# Altium schematic sheet PID Schematic.SchDoc
size 508 x 304 mm
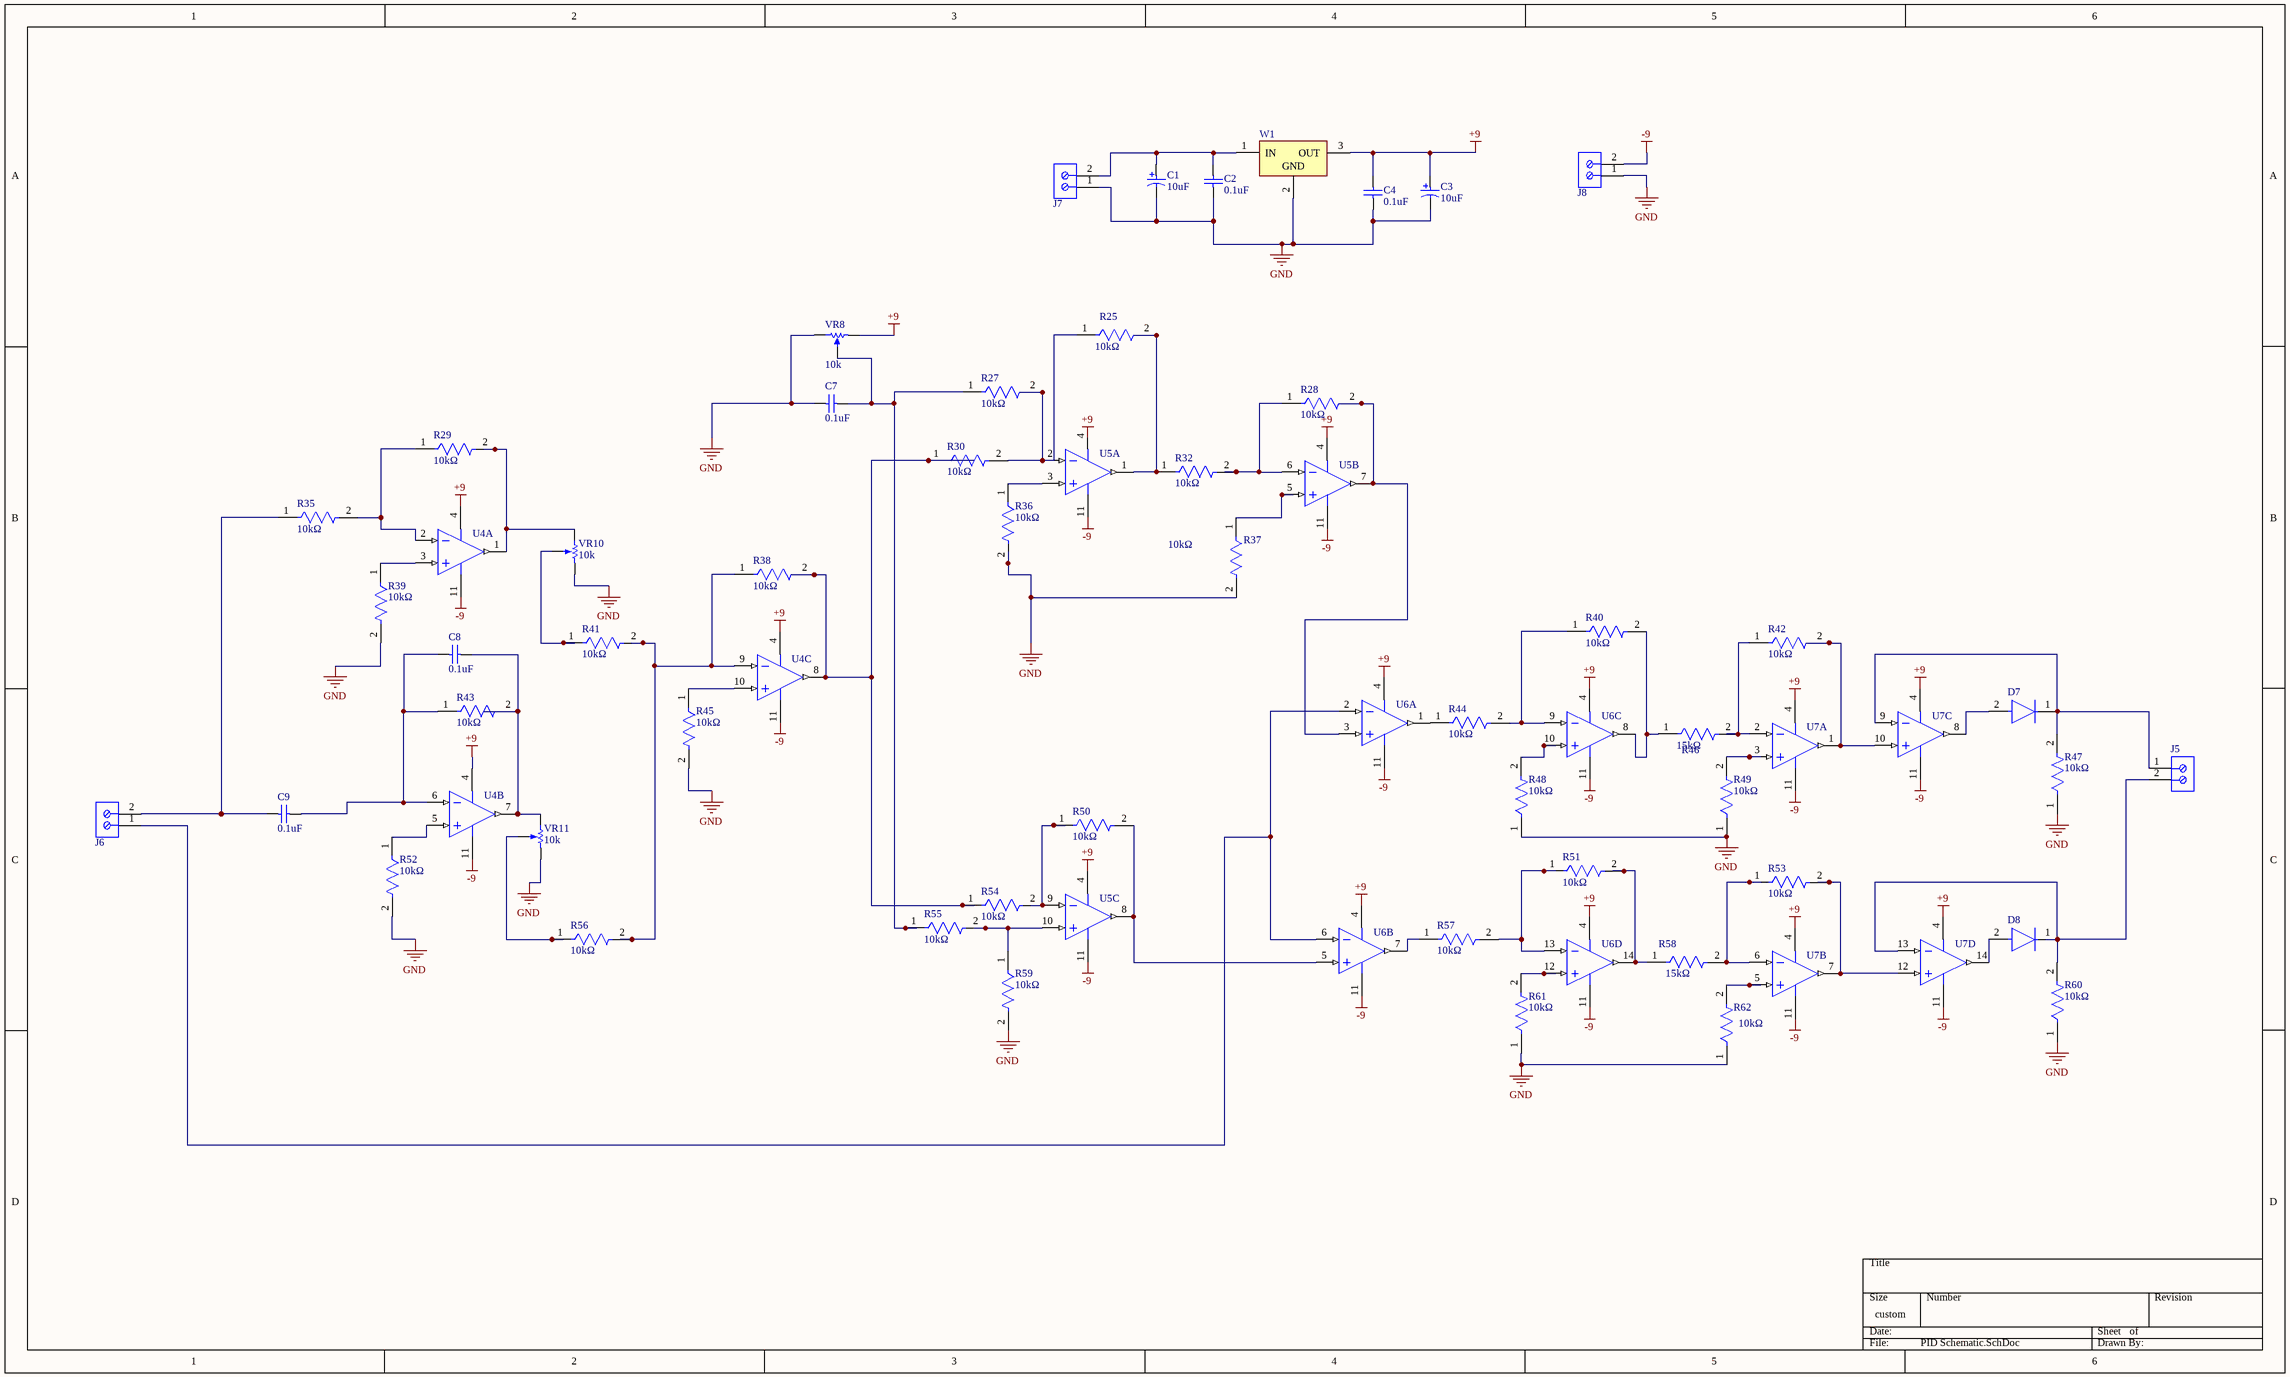
[diagram p0: PID Schematic.SchDoc]

## Parts
C1  Capacitance: 10uF  [CAPPR55-200-1100X500X1200]  (hidden comment: ECA1HM100)
C2  value 0.1uF  [CAPR51-254-508X318X736]  (hidden comment: C320C104K5R5TA)
C3  Capacitance: 10uF  [CAPPR55-200-1100X500X1200]  (hidden comment: ECA1HM100)
C4  value 0.1uF  [CAPR51-254-508X318X736]  (hidden comment: C320C104K5R5TA)
C7  value 0.1uF  [CAPR51-254-508X318X736]  (hidden comment: C320C104K5R5TA)
C8  value 0.1uF  [CAPR51-254-508X318X736]  (hidden comment: C320C104K5R5TA)
C9  value 0.1uF  [CAPR51-254-508X318X736]  (hidden comment: C320C104K5R5TA)
D7  1N4148  [FP-017AG-MFG]  (value not drawn)
D8  1N4148  [FP-017AG-MFG]  (value not drawn)
J5  691103110002  [691103110002]  (value not drawn)
J6  691103110002  [691103110002]  (value not drawn)
J7  691103110002  [691103110002]  (value not drawn)
J8  691103110002  [691103110002]  (value not drawn)
R25  Resistance: 10kΩ  [FP-MRS25-MFG]  (hidden comment: MRS25000C1101FCT00)
R27  Resistance: 10kΩ  [FP-MRS25-MFG]  (hidden comment: MRS25000C1101FCT00)
R28  Resistance: 10kΩ  [FP-MRS25-MFG]  (hidden comment: MRS25000C1101FCT00)
R29  Resistance: 10kΩ  [FP-MRS25-MFG]  (hidden comment: MRS25000C1101FCT00)
R30  Resistance: 10kΩ  [FP-MRS25-MFG]  (hidden comment: MRS25000C1101FCT00)
R32  Resistance: 10kΩ  [FP-MRS25-MFG]  (hidden comment: MRS25000C1101FCT00)
R35  Resistance: 10kΩ  [FP-MRS25-MFG]  (hidden comment: MRS25000C1101FCT00)
R36  Resistance: 10kΩ  [FP-MRS25-MFG]  (hidden comment: MRS25000C1101FCT00)
R37  Resistance: 10kΩ  [FP-MRS25-MFG]  (hidden comment: MRS25000C1101FCT00)
R38  Resistance: 10kΩ  [FP-MRS25-MFG]  (hidden comment: MRS25000C1101FCT00)
R39  Resistance: 10kΩ  [FP-MRS25-MFG]  (hidden comment: MRS25000C1101FCT00)
R40  Resistance: 10kΩ  [FP-MRS25-MFG]  (hidden comment: MRS25000C1101FCT00)
R41  Resistance: 10kΩ  [FP-MRS25-MFG]  (hidden comment: MRS25000C1101FCT00)
R42  Resistance: 10kΩ  [FP-MRS25-MFG]  (hidden comment: MRS25000C1101FCT00)
R43  Resistance: 10kΩ  [FP-MRS25-MFG]  (hidden comment: MRS25000C1101FCT00)
R44  Resistance: 10kΩ  [FP-MRS25-MFG]  (hidden comment: MRS25000C1101FCT00)
R45  Resistance: 10kΩ  [FP-MRS25-MFG]  (hidden comment: MRS25000C1101FCT00)
R46  Resistance: 15kΩ  [FP-MRS25-MFG]  (hidden comment: MRS25000C1101FCT00)
R47  Resistance: 10kΩ  [FP-MRS25-MFG]  (hidden comment: MRS25000C1101FCT00)
R48  Resistance: 10kΩ  [FP-MRS25-MFG]  (hidden comment: MRS25000C1101FCT00)
R49  Resistance: 10kΩ  [FP-MRS25-MFG]  (hidden comment: MRS25000C1101FCT00)
R50  Resistance: 10kΩ  [FP-MRS25-MFG]  (hidden comment: MRS25000C1101FCT00)
R51  Resistance: 10kΩ  [FP-MRS25-MFG]  (hidden comment: MRS25000C1101FCT00)
R52  Resistance: 10kΩ  [FP-MRS25-MFG]  (hidden comment: MRS25000C1101FCT00)
R53  Resistance: 10kΩ  [FP-MRS25-MFG]  (hidden comment: MRS25000C1101FCT00)
R54  Resistance: 10kΩ  [FP-MRS25-MFG]  (hidden comment: MRS25000C1101FCT00)
R55  Resistance: 10kΩ  [FP-MRS25-MFG]  (hidden comment: MRS25000C1101FCT00)
R56  Resistance: 10kΩ  [FP-MRS25-MFG]  (hidden comment: MRS25000C1101FCT00)
R57  Resistance: 10kΩ  [FP-MRS25-MFG]  (hidden comment: MRS25000C1101FCT00)
R58  Resistance: 15kΩ  [FP-MRS25-MFG]  (hidden comment: MRS25000C1101FCT00)
R59  Resistance: 10kΩ  [FP-MRS25-MFG]  (hidden comment: MRS25000C1101FCT00)
R60  Resistance: 10kΩ  [FP-MRS25-MFG]  (hidden comment: MRS25000C1101FCT00)
R61  Resistance: 10kΩ  [FP-MRS25-MFG]  (hidden comment: MRS25000C1101FCT00)
R62  Resistance: 10kΩ  [FP-MRS25-MFG]  (hidden comment: MRS25000C1101FCT00)
U4  LM324N  [N0014A]  (value not drawn)  (parts A,B,C of 4)
U5  LM324N  [N0014A]  (value not drawn)  (parts A,B,C of 4)
U6  LM324N  [N0014A]  (value not drawn)  (parts A,B,C,D of 4)
U7  LM324N  [N0014A]  (value not drawn)  (parts A,B,C,D of 4)
VR8  Resistance: 10k  [BOUR-3296W]  (hidden comment: 3296W-1-103LF)
VR10  Resistance: 10k  [BOUR-3296W]  (hidden comment: 3296W-1-103LF)
VR11  Resistance: 10k  [BOUR-3296W]  (hidden comment: 3296W-1-103LF)
W1  L7809CV  [TO220]  (value not drawn)

## Nets
+9: C3.1 C4.1 U4.4(V+) U5.4(V+) U6.4(V+) U7.4(V+) VR8.3(CW) W1.3(OUT)
-9: J8.2 U4.11(GND) U5.11(GND) U6.11(GND) U7.11(GND)
GND: C1.2 C2.2 C3.2 C4.2 C7.1 J7.1 J8.1 R36.2 R37.2 R39.2 R45.2 R47.1 R48.1 R49.1 R52.2 R59.2 R60.1 R61.1 R62.1 VR8.1(CCW) VR10.3(CW) VR11.3(CW) W1.2(GND)
NetC1_1: C1.1 C2.1 J7.2 W1.1(IN)
NetC7_2: C7.2 R27.1 R55.1 VR8.2(S)
NetC8_1: C8.1 C9.2 R43.1 U4.6(IN2-)
NetC8_2: C8.2 R43.2 U4.7(OUT2) VR11.1(CCW)
NetC9_1: C9.1 J6.2 R35.1
NetD7_1: D7.1(C) J5.1 R47.2 U7.9(IN3-)
NetD7_2: D7.2(A) U7.8(OUT3)
NetD8_1: D8.1(C) J5.2 R60.2 U7.13(IN4-)
NetD8_2: D8.2(A) U7.14(OUT4)
NetJ6_1: J6.1 U6.2(IN1-) U6.6(IN2-)
NetR25_1: R25.1 R27.2 R30.2 U5.2(IN1-)
NetR25_2: R25.2 R32.1 U5.1(OUT1)
NetR28_1: R28.1 R32.2 U5.6(IN2-)
NetR28_2: R28.2 U5.7(OUT2) U6.3(IN1+)
NetR29_1: R29.1 R35.2 U4.2(IN1-)
NetR29_2: R29.2 U4.1(OUT1) VR10.1(CCW)
NetR30_1: R30.1 R38.2 R54.1 U4.8(OUT3)
NetR36_1: R36.1 U5.3(IN1+)
NetR37_1: R37.1 U5.5(IN2+)
NetR38_1: R38.1 R41.2 R56.2 U4.9(IN3-)
NetR39_1: R39.1 U4.3(IN1+)
NetR40_1: R40.1 R44.2 U6.9(IN3-)
NetR40_2: R40.2 R46.1 U6.8(OUT3)
NetR41_1: R41.1 VR10.2(S)
NetR42_1: R42.1 R46.2 U7.2(IN1-)
NetR42_2: R42.2 U7.1(OUT1) U7.10(IN3+)
NetR44_1: R44.1 U6.1(OUT1)
NetR45_1: R45.1 U4.10(IN3+)
NetR48_2: R48.2 U6.10(IN3+)
NetR49_2: R49.2 U7.3(IN1+)
NetR50_1: R50.1 R54.2 U5.9(IN3-)
NetR50_2: R50.2 U5.8(OUT3) U6.5(IN2+)
NetR51_1: R51.1 R57.2 U6.13(IN4-)
NetR51_2: R51.2 R58.1 U6.14(OUT4)
NetR52_1: R52.1 U4.5(IN2+)
NetR53_1: R53.1 R58.2 U7.6(IN2-)
NetR53_2: R53.2 U7.7(OUT2) U7.12(IN4+)
NetR55_2: R55.2 R59.1 U5.10(IN3+)
NetR56_1: R56.1 VR11.2(S)
NetR57_1: R57.1 U6.7(OUT2)
NetR61_2: R61.2 U6.12(IN4+)
NetR62_2: R62.2 U7.5(IN2+)

## Notes on the sheet
- Labels drawn without touching a wire or pin: +9

## Library data of the parts
C1 C3 = CMP-1665-00038-2: Aluminum Electrolytic Capacitor, 10 uF, +/- 20%, 50 V, -40 to 85 degC, 2-Pin THD, RoHS, Bulk; Manufacturer: Panasonic; Life (Hours): 2000Hour; Lead/Base Style: Straight; Dissipation Factor: 0.12%; Leakage Current: 3uA; Dielectric Material: Aluminium; Lead Diameter: 0.5mm; Voltage Rating: 50V; Ripple Current: 65mA; Package Reference: CAPPR55-200-1100X500X1200; Height: 11mm; Diameter: 5mm; REACH SVHC: NoSVHC; Mount: ThroughHole; Packaging: Bulk; Manufacturer URL: http://www.panasonic.com/; Termination: Radial; Datasheet URL: https://industrial.panasonic.com/cdbs/www-data/pdf/RDF0000/ABA0000C1218.pdf; Lead Free: LeadFree; Height - Seated (Max): 0.472inch; Case/Package: Radial; Package Description: 2-Pin Radial Lead, Dia 5 mm, Height 12 mm; Tolerance: 20%; Datasheet Version: Rev. 05, 10/2016; Package Quantity: 200; Ripple Current (AC): 65mA; Min Operating Temperature: -40degC; RoHSCompliant: true; Number of Pins: 2; Max Operating Temperature: 85degC; Voltage: 50V; Lead Pitch: 2mm; Radiation Hardening: No; Voltage Rating (DC): 50V; Length: 11mm
C2 C4 C7-C9 = CMP-1664-00004-1: Radial Leaded Multilayer Ceramic Capacitor, 0.1 uF, +/- 10%, 50 V, -55 to 125 degC, 2-Pin THD, RoHS, Tape and Reel; Case\Package: SOT-23-5; Max Power Dissipation: 250 mW; Output Current: 150 mA; Dropout Voltage: 260 mV; Outputs: 1; Output Voltage: 5 V; Max Input Voltage: 8 V; Min Operating Temperature: -40 degC; Packaging: Tape and Reel; Height: 1.3 mm; Radiation Hardening: No; Pins: 5; ComponentLink1Description: Manufacturer URL; Mount: Surface Mount; RoHSCompliant: true; Max Operating Temperature: 85 degC; PackageReference: CAPR51-254-508X318X736; ComponentLink2URL: http://www.kemet.com/docfinder?Partnumber=C320C104K5R5TA; PackageDescription: 2-Pin Through Hole Device, Body 5.08 x 3.18 mm, Pitch 2.54 mm; ComponentLink1URL: http://www.kemet.com/; Width: 1.8 mm; Package Quantity: 3000; DatasheetVersion: Dec-15; Length: 3 mm; ComponentLink2Description: Datasheet
D7 D8 = CMP-07163-000046-1: DIODE GEN PURP 100V 200MA DO35; Forward Voltage: 1V; Max Power Dissipation: 500mW; Max Reverse Current: 5uA; Forward Current: 300mA; Current: 4A; Reverse Recovery Time: 4ns; Element Configuration: Single; Outside Diameter: 1.85mm; Capacitance: 4pF; Polarity: Standard; Max Forward Surge Current (Ifsm): 1A; Reverse Voltage: 100V; Output Current: 200mA; Average Rectified Current: 200mA; Diameter: 1.91mm; Max Repetitive Reverse Voltage (Vrrm): 100V; Current Rating: 200mA; Case/Package: DO-35; Lead Free: Lead Free; Number of Pins: 2; Recovery Time: 4ns; Packaging: Bulk; Contact Plating: Tin; Voltage: 100V; Mount: Through Hole; Max Surge Current: 4A; Package Quantity: 2000; Width: 1.91mm; Max Reverse Voltage (DC): 100V; Length: 4.56mm; Radiation Hardening: No; Power Dissipation: 500mW; Voltage Rating (DC): 100V; Peak Non-Repetitive Surge Current: 4A; REACH SVHC: No SVHC; Height: 4.56mm; Max Operating Temperature: 175°C; Series: -; Weight: 0.01lb; Min Operating Temperature: -65°C
J5-J8 = CMP-1502-03254-1: Series 1031 - 3.50 mm Horizontal Entry Modular with Pressure Clamp WR-TBL, 2 pin; Manufacturer: Wurth Elektronik; Pin Number: 2; Pitch: 3.50mm; Datasheet URL: http://katalog.we-online.de/em/datasheet/6911031100xx.pdf; Package Reference: 691103110002; Publisher: WurthElektronik; Manufacturer URL: http://www.we-online.de; Mounting Technology: THT; Operating Temperature: -40to105degC; Part Number: 691103110002; Packaging: Box
R25 R27-R30 R32 R35-R62 = CMP-02408-000003-1: RES 1.1K OHM 0.6W 1% AXIAL; Manufacturer: Vishay BC Components; Voltage Rating: 350V; Temperature Coefficient: 50ppm/°C; Value: 1.1kΩ; Device Class L1: Passive Components; Height: 2.5mm; Octopart: https://octopart.com/mrs25000c1101fct00-vishay-43740214; Temperature Range Low: -55°C; Temperature: -55°C to +155°C; Temperature Range High: +155°C; Lead Free: Yes; Mouser Description: Thin Film Resistors .6watt 1.1Kohms 1%; Power Rating: 0.6W; Digikey Description: RES 1.1K OHM 0.6W 1% AXIAL; RoHS: TRUE; Tolerance: 1%; Package: MRS25; Device Class L3: Through-Hole Resistors; ComponentLink2URL: http://www.vishay.com/docs/28724/mrs16m25.pdf; ComponentLink2Description: Datasheet; Composition: Thin Film; Automotive: No; Ipc Land Pattern Name: RESAD1000W75L650D250; Device Class L2: Resistors; Category: Res; Series: MRS25; Manufacturer Part Number: MRS25000C1101FCT00
U4-U7 = CMP-0055-00082-3: Low Power Quad Operational Amplifier, 14-pin MDIP; Manufacturer: Texas Instruments; CompType: Amplifiers; PowerWise: N; PackageTopMarking: NSUZXYYTTE#*LM324N; PackageDescription: MDIP, .750 x .250 x.130in, 14 Lead, .100in Pitch; Package Reference: N0014A; RoHS: N; Code_JEDEC: MS-001-AA; ComponentLink1URL: http://www.ti.com/general/docs/lit/getliterature.tsp?genericPartNumber=LM324&fileType=pdf; ComponentLink1Description: Datasheet URL; PinCount: 14
VR8 VR10 VR11 = CMP-1747-00001-1: Square Trimpot(R) Trimming Potentiometer, 10 KOhm, +/- 10%, 0.5 W, -55 to 125 degC, 3-Pin THD, RoHS, Tube; Voltage Rating: 75 V; Tolerance: 1%; Power Rating: 100 mW; Case\Package: 0603; Type (Resistor): Thick Film; PackageDescription: 3-Pin Through Hole Device, Body 9.53 x 4.83 mm, Pitch 2.54 mm; RoHSCompliant: true; Package Quantity: 5000; Case Code (Metric): 1608; PackageReference: 3296W; ComponentLink2Description: Datasheet; REACH SVHC: Unknown; Case Code (Imperial): 0603; ComponentLink1URL: http://www.bourns.com/; Width: 0.85 mm; Radiation Hardening: No; Min Operating Temperature: -55 degC; Mount: Surface Mount; ComponentLink1Description: Manufacturer URL; Max Operating Temperature: 155 degC; Weight: 7.1E-05 oz; Pins: 2; DatasheetVersion: May-16; Packaging: Tape and Reel; Height: 0.45 mm; Length: 1.55 mm; ComponentLink2URL: http://www.bourns.com/docs/Product-Datasheets/3296.pdf
W1 = CMP-0244-00459-1: Positive Voltage Regulator, 9V, 3-Pin TO-220; ComponentLink3URL: http://www.st.com/internet/com/TECHNICAL_RESOURCES/TECHNICAL_LITERATURE/PACKAGE_INFORMATION/CD00004649.pdf; ComponentLink2Description: Datasheet; DatasheetVersion: 16/11/2011; PackageVersion: ver3.0; PackageDescription: TO, Thru-Hole, Vertical, Heatsink Mounted; 3 In-Line Leads; Pitch 2.54 mm; ComponentLink3Description: Package Specification; ComponentLink2URL: http://www.st.com/internet/com/TECHNICAL_RESOURCES/TECHNICAL_LITERATURE/DATASHEET/CD00000444.pdf; ComponentLink1URL: http://www.st.com; ComponentLink1Description: Manufacturer URL; PackageReference: TO220